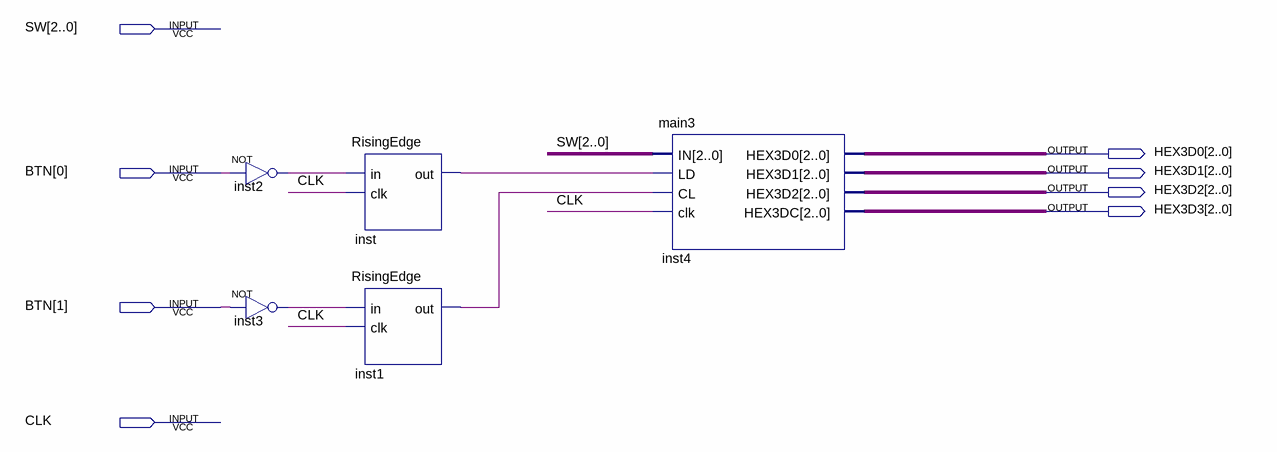
[diagram p0: schematic sheet]
// Quartus schematic test_main3.bdf as structural Verilog: 5 symbols, 8 pins
module test_main3 (
  input  [2:0] SW,
  input  [1:0] BTN,
  input  CLK,
  output [2:0] HEX3D0,
  output [2:0] HEX3D1,
  output [2:0] HEX3D2,
  output [2:0] HEX3D3
);

  wire inst1_out, inst2_out, inst3_out, inst_out;

  not inst2 (inst2_out, BTN[0]);
  not inst3 (inst3_out, BTN[1]);
  RisingEdge inst (.in(inst2_out), .clk(CLK), .out(inst_out));
  RisingEdge inst1 (.in(inst3_out), .clk(CLK), .out(inst1_out));
  main3 inst4 (
    .IN(SW), .LD(inst_out), .CL(inst1_out), .clk(CLK), .HEX3D0(HEX3D0), .HEX3D1(HEX3D1), .HEX3D2(HEX3D2),
    .HEX3DC(HEX3D3));
endmodule
